# EAGLE schematic MainCircuit (EAGLE 9.7.0)
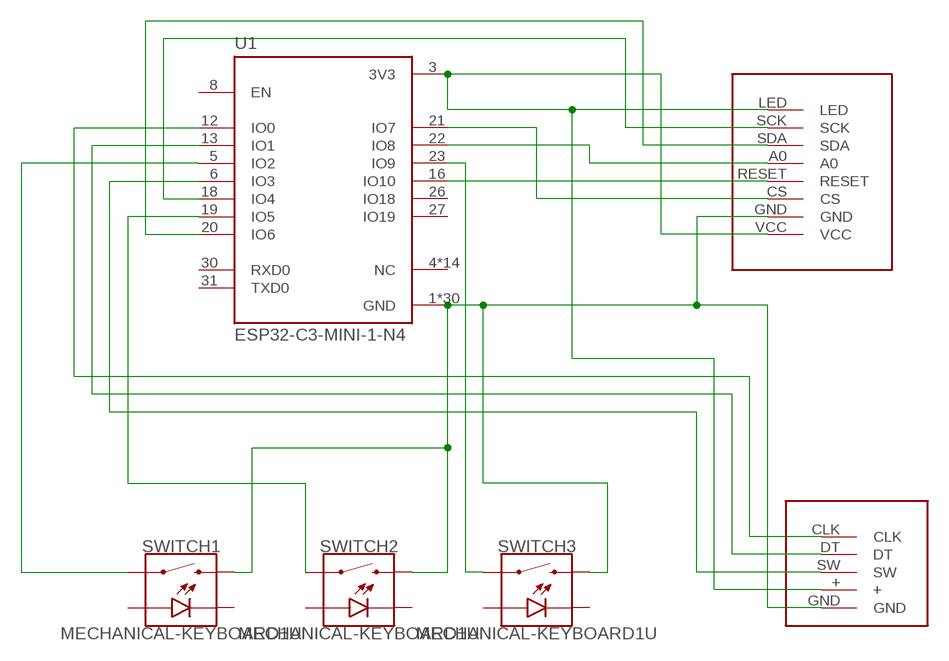
[diagram p0: schematic, sheet 1]

## Parts
ROTARYENCODER  ROTARYENCODER  [ROTARY]
SWITCH1  MECHANICAL-KEYBOARD1U  [CHERRY-MX-LED-1U]
SWITCH2  MECHANICAL-KEYBOARD1U  [CHERRY-MX-LED-1U]
SWITCH3  MECHANICAL-KEYBOARD1U  [CHERRY-MX-LED-1U]
U1  ESP32-C3-MINI-1-N4  [XCVR_ESP32-C3-MINI-1-N4]
U$1  ST7735_1.8_TFT  [ST7735_1.8_TFT]

## Nets
N$1: ROTARYENCODER.GND SWITCH1.S2 SWITCH2.S2 SWITCH3.S2 U1.1(GND) U1.2(GND) U1.11(GND) U1.14(GND) U1.36(GND) U1.37(GND) U1.38(GND) U1.39(GND) U1.40(GND) U1.41(GND) U1.42(GND) U1.43(GND) U1.44(GND) U1.45(GND) U1.46(GND) U1.47(GND) U1.48(GND) U1.49_1(GND) U1.49_2(GND) U1.49_3(GND) U1.49_4(GND) U1.49_5(GND) U1.49_6(GND) U1.49_7(GND) U1.49_8(GND) U1.49_9(GND) U1.50(GND) U1.51(GND) U1.52(GND) U1.53(GND) U$1.GND
N$2: ROTARYENCODER.+ U1.3(3V3) U$1.LED U$1.VCC
N$3: U1.20(IO6) U$1.SDA
N$4: U1.18(IO4) U$1.SCK
N$5: U1.16(IO10) U$1.RESET
N$6: U1.22(IO8) U$1.A0
N$7: U1.21(IO7) U$1.CS
N$8: ROTARYENCODER.CLK U1.12(IO0)
N$9: ROTARYENCODER.DT U1.13(IO1)
N$10: ROTARYENCODER.SW U1.6(IO3)
N$11: SWITCH1.S1 U1.5(IO2)
N$12: SWITCH2.S1 U1.19(IO5)
N$13: SWITCH3.S1 U1.23(IO9)
Unconnected: SWITCH1.A SWITCH1.K(C) SWITCH2.A SWITCH2.K(C) SWITCH3.A SWITCH3.K(C) U1.4(NC) U1.7(NC) U1.8(EN) U1.9(NC) U1.10(NC) U1.15(NC) U1.17(NC) U1.24(NC) U1.25(NC) U1.26(IO18) U1.27(IO19) U1.28(NC) U1.29(NC) U1.30(RXD0) U1.31(TXD0) U1.32(NC) U1.33(NC) U1.34(NC) U1.35(NC)

## Library data of the parts
ROTARYENCODER = TFT1.8:ROTARYENCODER
SWITCH1-SWITCH3 = SparkFun-Switches:MECHANICAL-KEYBOARD: Mechanical Keyboard Spacings for Cherry-MX Cherry-MX w/ LED switch footprints. Each package variant contains a bounding box on the tDocu layer for proper key spacing and a dimensional drawing on the Reference layer to be exported for laser cut mounting plates. Footprints are off-center so that the origin lies on the lower left corner of the key-spacing. This allows for most common layouts to be easily acheived on a grid spacing of 0.1875" Variants 1U through 1.75U in .25U steps Centered switch cutout in SwitchPlate layer with no stabilizers 2U through 2.75U in .25U steps Centered switch cutout in SwitchPlate layer with Cherry+Costar stabilizer holes 6.25U Common spacebar size Centered switch cutout in SwitchPlate layer with Cherry+Costar stabilizer holes "Big Ass" Enter ANSI 104 "Big Ass" Enter Key layout ISO Enter ISO style Enter Key layout
U1 = ESP32-C3-MINI-1-N4:ESP32-C3-MINI-1-N4: Check availability <https://pricing.snapeda.com/parts/ESP32-C3-MINI-1-N4/Espressif%20Systems/view-part?ref=eda>
U$1 = TFT1.8:ST7735_1.8_TFT